# Altium schematic sheet Comparators.SchDoc
size A; SheetNumber: 4; SheetTotal: 11
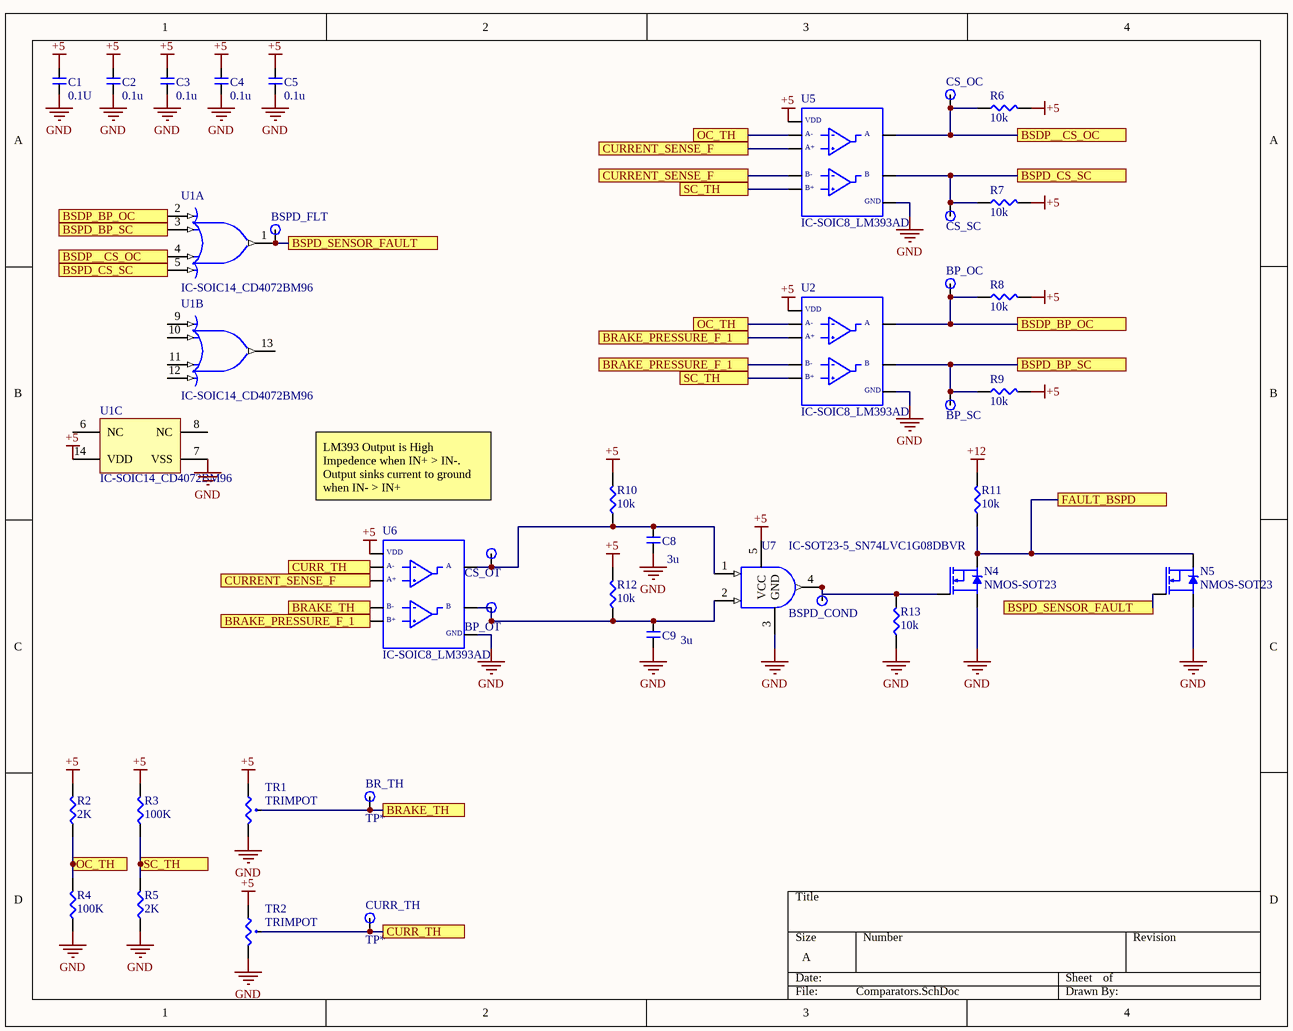
[diagram p0: Comparators.SchDoc]

## Parts
BP_OC  (no value)  [Testpoint]
BP_OT  (no value)  [Testpoint]
BP_SC  (no value)  [Testpoint]
BR_TH  TP*  [Testpoint]
BSPD_COND  (no value)  [Testpoint]
BSPD_FLT  (no value)  [Testpoint]
C1  0.1U  [CAP-0603]
C2  0.1u  [CAP-0603]
C3  0.1u  [CAP-0603]
C4  0.1u  [CAP-0603]
C5  0.1u  [CAP-0603]
C8  3u  [CAP-0603]
C9  3u  [CAP-0603]
CS_OC  (no value)  [Testpoint]
CS_OT  (no value)  [Testpoint]
CS_SC  (no value)  [Testpoint]
CURR_TH  TP*  [Testpoint]
N4  NMOS-SOT23  [SOT23]
N5  NMOS-SOT23  [SOT23]
R2  2K  [RES-0603]
R3  100K  [RES-0603]
R4  100K  [RES-0603]
R5  2K  [RES-0603]
R6  10k  [RES-0603]
R7  10k  [RES-0603]
R8  10k  [RES-0603]
R9  10k  [RES-0603]
R10  10k  [RES-0603]
R11  10k  [RES-0603]
R12  10k  [RES-0603]
R13  10k  [RES-0603]
TR1  TRIMPOT  [TRIMPOT_PV36W]
TR2  TRIMPOT  [TRIMPOT_PV36W]
U1  IC-SOIC14_CD4072BM96  [SOIC127P600X175-14N]  (parts A,B,C of 3)
U2  IC-SOIC8_LM393AD  [SOIC8]
U5  IC-SOIC8_LM393AD  [SOIC8]
U6  IC-SOIC8_LM393AD  [SOIC8]
U7  IC-SOT23-5_SN74LVC1G08DBVR  [SOT95P280X110-5N]

## Ports
BRAKE_PRESSURE_F_1, BRAKE_TH, BSDP__CS_OC, BSDP_BP_OC, BSPD_BP_SC, BSPD_CS_SC, BSPD_SENSOR_FAULT, CURR_TH, CURRENT_SENSE_F, FAULT_BSPD, OC_TH, SC_TH

## Nets
+5: C1.2 C2.2 C3.2 C4.2 C5.2 R2.2 R3.2 R6.2 R7.2 R8.2 R9.2 R10.2 R12.2 TR1.1 TR2.1 U1.14(VDD) U2.8 U5.8 U6.8 U7.5(VCC)
+12: R11.2
GND: C1.1 C2.1 C3.1 C4.1 C5.1 C8.1 C9.1 N4.2(S) N5.2(S) R4.1 R5.1 R13.1 TR1.3 TR2.3 U1.7(VSS) U2.4 U5.4 U6.4 U7.3(GND)
BRAKE_PRESSURE_F_1: U2.3 U2.6 U6.5 ; port BRAKE_PRESSURE_F_1
BRAKE_TH: BR_TH.1 TR1.2 U6.6 ; port BRAKE_TH
BSDP__CS_OC: CS_OC.1 R6.1 U1.4(C) U5.1 ; port BSDP__CS_OC
BSDP_BP_OC: BP_OC.1 R8.1 U1.2(A) U2.1 ; port BSDP_BP_OC
BSPD_BP_SC: BP_SC.1 R9.1 U1.3(B) U2.7 ; port BSPD_BP_SC
BSPD_CS_SC: CS_SC.1 R7.1 U1.5(D) U5.7 ; port BSPD_CS_SC
BSPD_SENSOR_FAULT: BSPD_FLT.1 N5.1(G) U1.1(J) ; port BSPD_SENSOR_FAULT
CURR_TH: CURR_TH.1 TR2.2 U6.2 ; port CURR_TH
CURRENT_SENSE_F: U5.3 U5.6 U6.3 ; port CURRENT_SENSE_F
FAULT_BSPD: N4.3(D) N5.3(D) R11.1 ; port FAULT_BSPD
OC_TH: R2.1 R4.2 U2.2 U5.2 ; port OC_TH
SC_TH: R3.1 R5.2 U2.5 U5.5 ; port SC_TH
NetBP_OT_1: BP_OT.1 C9.2 R12.1 U6.7 U7.2(B)
NetBSPD_COND_1: BSPD_COND.1 N4.1(G) R13.2 U7.4(Y)
NetC8_2: C8.2 CS_OT.1 R10.1 U6.1 U7.1(A)

Not connected (* = marked no-connect by the designer): U1 6(NC) 8(NC) 9(E) 10(F) 11(G) 12(H) 13(K)

## Notes on the sheet
- LM393 Output is High Impedence when IN+ > IN-.  Output sinks current to ground when IN- > IN+
- (in symbol IC-SOIC8_LM393) VDD; A-; A; A+; B-; B; B+; GND

## Library data of the parts
BP_OC BP_OT BP_SC BR_TH BSPD_COND BSPD_FLT CS_OC CS_OT CS_SC CURR_TH = Testpoint
C1-C5 C8 C9 = CAP-0603
R2-R13 = RES-0603
TR1 TR2 = TRIMPOT_PV36W
U1 = CMP-007-000052-1: Logic Gates CMOS Dual 4-Input OR; Manufacturer: Texas Instruments; Number of Bits: 2; Quiescent Current: 5uA; Low Level Output Current: 3.4mA; Max Supply Voltage: 18V; Number of Output Lines: 1; Propagation Delay: 90ns; Number of Input Lines: 4; Turn-On Delay Time: 120ns; Output Current: 6.8mA; Min Supply Voltage: 3V; Contact Plating: Gold; Number of Pins: 14; Stock 1: 5874; ComponentLink2URL: http://www.farnell.com/datasheets/1834701.pdf?src-supplier=Element14; Number of Circuits: 2; RoHS: Yes; ComponentLink3URL: http://www.produktinfo.conrad.com/datenblaetter/1000000-1099999/001073543-da-01-en-IC_DUAL_4INPUT_OR_CD4072BM96_SOIC_14_TID.pdf?src-supplier=Conrad; Weight: 0.004564oz; Number of Outputs: 1; ComponentLink3Description: http://www.produktinfo.conrad.com/datenblaetter/1000000-1099999/001073543-da-01-en-IC_DUAL_4INPUT_OR_CD4072BM96_SOIC_14_TID.pdf?src-supplier=Conrad; Max Operating Temperature: 125°C; Manufacturer Part Number: CD4072BM96; ComponentLink2Description: http://www.farnell.com/datasheets/1834701.pdf?src-supplier=Element14; Case/Package: SOIC; REACH SVHC: No SVHC; Mount: Surface Mount; Source: ife19_Elec_Library.schlib; Lead Free: Lead Free; Number of Elements: 2; ComponentLink1URL: http://www.ti.com/general/docs/lit/getliterature.tsp?genericPartNumber=CD4072B-MIL&&fileType=pdf&src-supplier=Avnet; Number of Inputs: 4; High Level Output Current: 3.4mA; Pricing 1: 1 = 0.42000, 10 = 0.35900, 100 = 0.26820, 500 = 0.21074, 1000 = 0.16284 (USD); Package Quantity: 1; Number of Gates: 2; ComponentLink1Description: http://www.ti.com/general/docs/lit/getliterature.tsp?genericPartNumber=CD4072B-MIL&&fileType=pdf&src-supplier=Avnet; Packaging: Tape and Reel; Design Item ID: IC-SOIC14_CD4072BM96; Min Operating Temperature: -55°C; Logic Function: OR
U2 U5 U6 = IC-SOIC8_LM393
U7 = IC-SOT23-5_SN74LVC1G08DBVR: IC GATE AND 1CH 2-INP SOT23-5; Manufacturer: Texas Instruments; Min Supply Voltage: 1.65V; Max Supply Voltage: 5.5V; Number of Inputs: 2; Propagation Delay: 4ns; Number of Circuits: 1; Quiescent Current: 10uA; High Level Output Current: -32mA; Low Level Output Current: 32mA; Turn-On Delay Time: 4.5ns; Supplier 1: Digi-Key; Manufacturer Part Number: SN74LVC1G08DBVR; Stock 1: 245825; Pricing 1: 1 = 0.43000, 10 = 0.32000, 100 = 0.19960, 500 = 0.13658, 1000 = 0.10506 (USD); RoHS: Yes; Mount: Surface Mount; Case/Package: SOT-23; Number of Pins: 5; Weight: 0.000557oz; Contact Plating: Gold; Min Operating Temperature: -40°C; Max Operating Temperature: 125°C; Packaging: Tape and Reel; Logic Function: AND; Package Quantity: 1; Number of Gates: 1; Number of Outputs: 1; Number of Input Lines: 2; Number of Elements: 1; Number of Output Lines: 1; Number of Bits: 1; Output Current: 32mA; Max Output Current: 32mA; Termination: SMD/SMT; Radiation Hardening: No; Lead Free: Lead Free; REACH SVHC: No SVHC; ComponentLink1URL: http://www.jameco.com/Jameco/Products/ProdDS/756490.pdf?src-supplier=Jameco; ComponentLink1Description: http://www.jameco.com/Jameco/Products/ProdDS/756490.pdf?src-supplier=Jameco; ComponentLink2URL: http://focus.ti.com/lit/ds/symlink/sn74lvc1g08.pdf?src-supplier=Avnet+Europe; ComponentLink2Description: http://focus.ti.com/lit/ds/symlink/sn74lvc1g08.pdf?src-supplier=Avnet+Europe; ComponentLink3URL: http://www.ti.com/general/docs/lit/getliterature.tsp?genericPartNumber=SN74LVC1G08&amp;&amp;fileType=pdf&src-supplier=Avnet+Asia; ComponentLink3Description: http://www.ti.com/general/docs/lit/getliterature.tsp?genericPartNumber=SN74LVC1G08&amp;&amp;fileType=pdf&src-supplier=Avnet+Asia; ComponentLink4URL: http://www.farnell.com/datasheets/1996458.pdf?src-supplier=Element14; ComponentLink4Description: http://www.farnell.com/datasheets/1996458.pdf?src-supplier=Element14; ComponentLink5URL: http://www.ti.com/lit/pdf/sdyu001?src-supplier=Digi-Key; ComponentLink5Description: http://www.ti.com/lit/pdf/sdyu001?src-supplier=Digi-Key; ComponentLink6URL: https://www.verical.com/server-webapp/html/getDatasheet?partID=39173&src-supplier=Verical; ComponentLink6Description: https://www.verical.com/server-webapp/html/getDatasheet?partID=39173&src-supplier=Verical; ComponentLink7URL: http://www.ti.com/general/docs/lit/getliterature.tsp?genericPartNumber=SN74LVC1G08&&fileType=pdf&src-supplier=Avnet; ComponentLink7Description: http://www.ti.com/general/docs/lit/getliterature.tsp?genericPartNumber=SN74LVC1G08&&fileType=pdf&src-supplier=Avnet; ComponentLink8URL: http://www.produktinfo.conrad.com/datenblaetter/1000000-1099999/001074511-da-01-en-IC_2_INPUT_SN74LVC1G08DBVR_SOT_23_5_TID.pdf?src-supplier=Conrad; ComponentLink8Description: http://www.produktinfo.conrad.com/datenblaetter/1000000-1099999/001074511-da-01-en-IC_2_INPUT_SN74LVC1G08DBVR_SOT_23_5_TID.pdf?src-supplier=Conrad